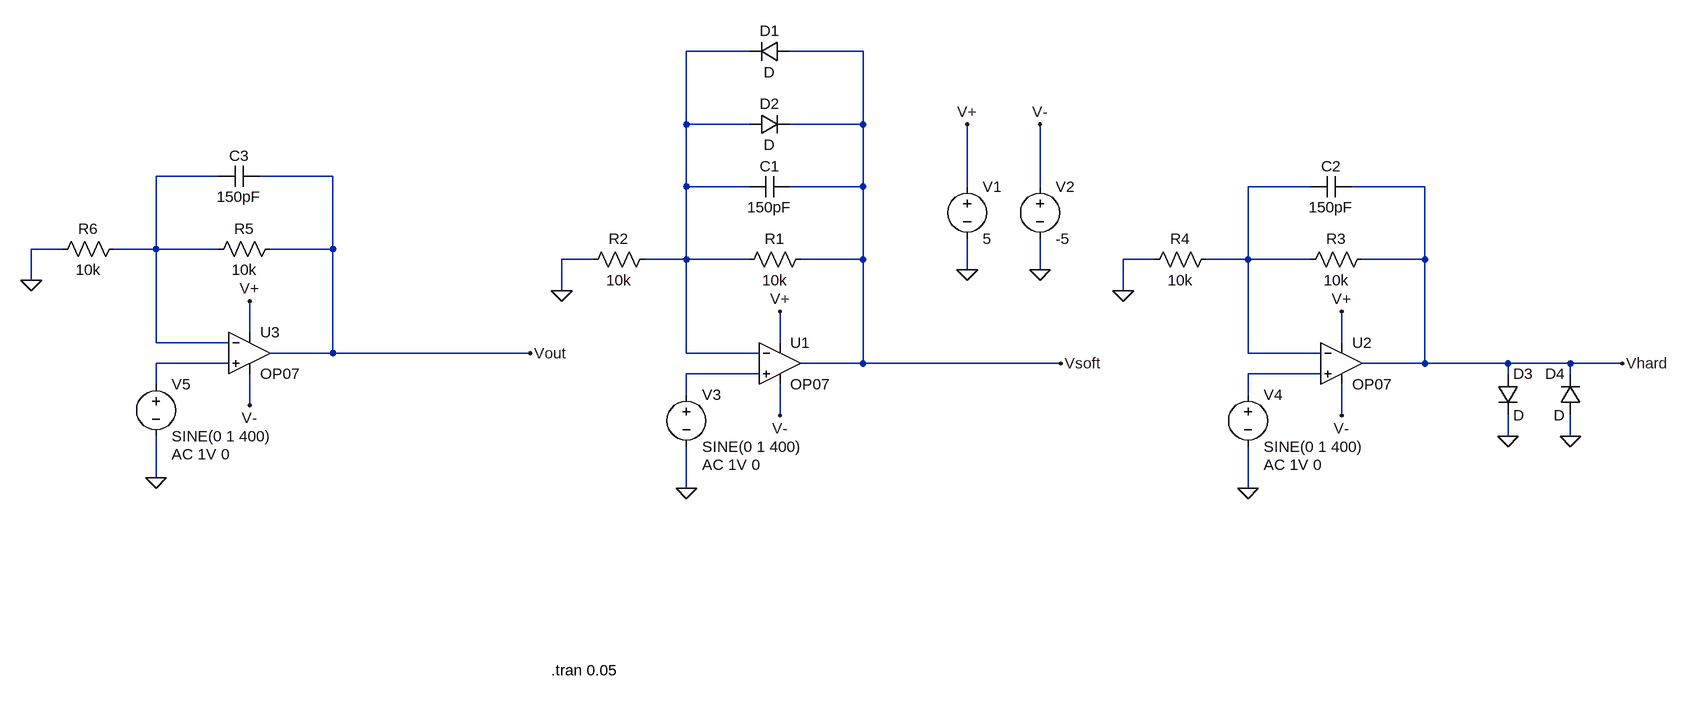
[diagram p0: schematic clipping_stage_sim.asc]
clipping_stage_sim.asc, the LTspice schematic file:
Version 4.1
SHEET 1 1560 680
WIRE 32 -464 -64 -464
WIRE 208 -464 96 -464
WIRE -64 -352 -64 -464
WIRE 32 -352 -64 -352
WIRE 208 -352 208 -464
WIRE 208 -352 96 -352
WIRE -784 -272 -880 -272
WIRE -608 -272 -720 -272
WIRE -64 -256 -64 -352
WIRE 32 -256 -64 -256
WIRE 208 -256 208 -352
WIRE 208 -256 96 -256
WIRE 368 -256 368 -352
WIRE 480 -256 480 -352
WIRE 896 -256 800 -256
WIRE 1072 -256 960 -256
WIRE -1024 -160 -1072 -160
WIRE -880 -160 -880 -272
WIRE -880 -160 -944 -160
WIRE -784 -160 -880 -160
WIRE -608 -160 -608 -272
WIRE -608 -160 -704 -160
WIRE -208 -144 -256 -144
WIRE -64 -144 -64 -256
WIRE -64 -144 -128 -144
WIRE 32 -144 -64 -144
WIRE 208 -144 208 -256
WIRE 208 -144 112 -144
WIRE 656 -144 608 -144
WIRE 800 -144 800 -256
WIRE 800 -144 736 -144
WIRE 896 -144 800 -144
WIRE 1072 -144 1072 -256
WIRE 1072 -144 976 -144
WIRE 368 -128 368 -176
WIRE 480 -128 480 -176
WIRE -1072 -112 -1072 -160
WIRE -256 -96 -256 -144
WIRE 608 -96 608 -144
WIRE -736 -32 -736 -80
WIRE -880 -16 -880 -160
WIRE -768 -16 -880 -16
WIRE 80 -16 80 -64
WIRE 944 -16 944 -64
WIRE -608 0 -608 -160
WIRE -608 0 -704 0
WIRE -304 0 -608 0
WIRE -64 0 -64 -144
WIRE 48 0 -64 0
WIRE 800 0 800 -144
WIRE 912 0 800 0
WIRE -768 16 -880 16
WIRE 208 16 208 -144
WIRE 208 16 112 16
WIRE 512 16 208 16
WIRE 1072 16 1072 -144
WIRE 1072 16 976 16
WIRE 1200 16 1072 16
WIRE 1296 16 1200 16
WIRE 1376 16 1296 16
WIRE 48 32 -64 32
WIRE 912 32 800 32
WIRE 1200 32 1200 16
WIRE 1296 32 1296 16
WIRE -880 48 -880 16
WIRE -64 64 -64 32
WIRE 800 64 800 32
WIRE -736 80 -736 32
WIRE 80 96 80 48
WIRE 944 96 944 48
WIRE 1200 128 1200 96
WIRE 1296 128 1296 96
WIRE -880 192 -880 128
WIRE -64 208 -64 144
WIRE 800 208 800 144
FLAG 368 -128 0
FLAG 480 -128 0
FLAG 368 -352 V+
FLAG 480 -352 V-
FLAG 80 -64 V+
FLAG 80 96 V-
FLAG -64 208 0
FLAG -256 -96 0
FLAG 512 16 Vsoft
FLAG 944 -64 V+
FLAG 944 96 V-
FLAG 800 208 0
FLAG 608 -96 0
FLAG 1200 128 0
FLAG 1296 128 0
FLAG 1376 16 Vhard
FLAG -736 -80 V+
FLAG -736 80 V-
FLAG -880 192 0
FLAG -1072 -112 0
FLAG -304 0 Vout
SYMBOL OpAmps\\OP07 80 -48 R0
SYMATTR InstName U1
SYMBOL voltage 368 -272 R0
SYMATTR InstName V1
SYMATTR Value 5
SYMBOL voltage 480 -272 R0
SYMATTR InstName V2
SYMATTR Value -5
SYMBOL voltage -64 48 R0
WINDOW 123 24 124 Left 2
WINDOW 39 0 0 Left 0
SYMATTR InstName V3
SYMATTR Value SINE(0 1 400)
SYMATTR Value2 AC 1V 0
SYMBOL res 128 -160 R90
WINDOW 0 0 56 VBottom 2
WINDOW 3 32 56 VTop 2
SYMATTR InstName R1
SYMATTR Value 10k
SYMBOL cap 96 -272 R90
WINDOW 0 0 32 VBottom 2
WINDOW 3 32 32 VTop 2
SYMATTR InstName C1
SYMATTR Value 150pF
SYMBOL diode 96 -480 R90
WINDOW 0 0 32 VBottom 2
WINDOW 3 32 32 VTop 2
SYMATTR InstName D1
SYMBOL diode 32 -336 R270
WINDOW 0 32 32 VTop 2
WINDOW 3 0 32 VBottom 2
SYMATTR InstName D2
SYMBOL res -112 -160 R90
WINDOW 0 0 56 VBottom 2
WINDOW 3 32 56 VTop 2
SYMATTR InstName R2
SYMATTR Value 10k
SYMBOL OpAmps\\OP07 944 -48 R0
SYMATTR InstName U2
SYMBOL voltage 800 48 R0
WINDOW 123 24 124 Left 2
WINDOW 39 0 0 Left 0
SYMATTR InstName V4
SYMATTR Value SINE(0 1 400)
SYMATTR Value2 AC 1V 0
SYMBOL res 992 -160 R90
WINDOW 0 0 56 VBottom 2
WINDOW 3 32 56 VTop 2
SYMATTR InstName R3
SYMATTR Value 10k
SYMBOL cap 960 -272 R90
WINDOW 0 0 32 VBottom 2
WINDOW 3 32 32 VTop 2
SYMATTR InstName C2
SYMATTR Value 150pF
SYMBOL res 752 -160 R90
WINDOW 0 0 56 VBottom 2
WINDOW 3 32 56 VTop 2
SYMATTR InstName R4
SYMATTR Value 10k
SYMBOL diode 1184 32 R0
SYMATTR InstName D3
SYMBOL diode 1312 96 R180
WINDOW 0 24 64 Left 2
WINDOW 3 24 0 Left 2
SYMATTR InstName D4
SYMBOL OpAmps\\OP07 -736 -64 R0
SYMATTR InstName U3
SYMBOL voltage -880 32 R0
WINDOW 123 24 124 Left 2
WINDOW 39 0 0 Left 0
SYMATTR InstName V5
SYMATTR Value SINE(0 1 400)
SYMATTR Value2 AC 1V 0
SYMBOL res -688 -176 R90
WINDOW 0 0 56 VBottom 2
WINDOW 3 32 56 VTop 2
SYMATTR InstName R5
SYMATTR Value 10k
SYMBOL cap -720 -288 R90
WINDOW 0 0 32 VBottom 2
WINDOW 3 32 32 VTop 2
SYMATTR InstName C3
SYMATTR Value 150pF
SYMBOL res -928 -176 R90
WINDOW 0 0 56 VBottom 2
WINDOW 3 32 56 VTop 2
SYMATTR InstName R6
SYMATTR Value 10k
TEXT -272 488 Left 2 !.tran 0.05

The netlist it stands for:
* clipping_stage_sim.asc
X§U1 N005 N001 V+ V- Vsoft LT1001  ; OP07, pins In+ In- V+ V- OUT
V1 V+ 0 5
V2 V- 0 -5
V3 N005 0 SINE(0 1 400) AC 1V 0
R1 Vsoft N001 10k
C1 Vsoft N001 150pF
D1 Vsoft N001 D
D2 N001 Vsoft D
R2 N001 0 10k
X§U2 N006 N003 V+ V- Vhard LT1001  ; OP07, pins In+ In- V+ V- OUT
V4 N006 0 SINE(0 1 400) AC 1V 0
R3 Vhard N003 10k
C2 Vhard N003 150pF
R4 N003 0 10k
D3 Vhard 0 D
D4 0 Vhard D
X§U3 N004 N002 V+ V- Vout LT1001  ; OP07, pins In+ In- V+ V- OUT
V5 N004 0 SINE(0 1 400) AC 1V 0
R5 Vout N002 10k
C3 Vout N002 150pF
R6 N002 0 10k
.model D D
.lib standard.dio
.tran 0.05
.lib LTC.lib
.backanno
.end